# Altium project FYP_ECG_ACCEL_board.PrjPcb
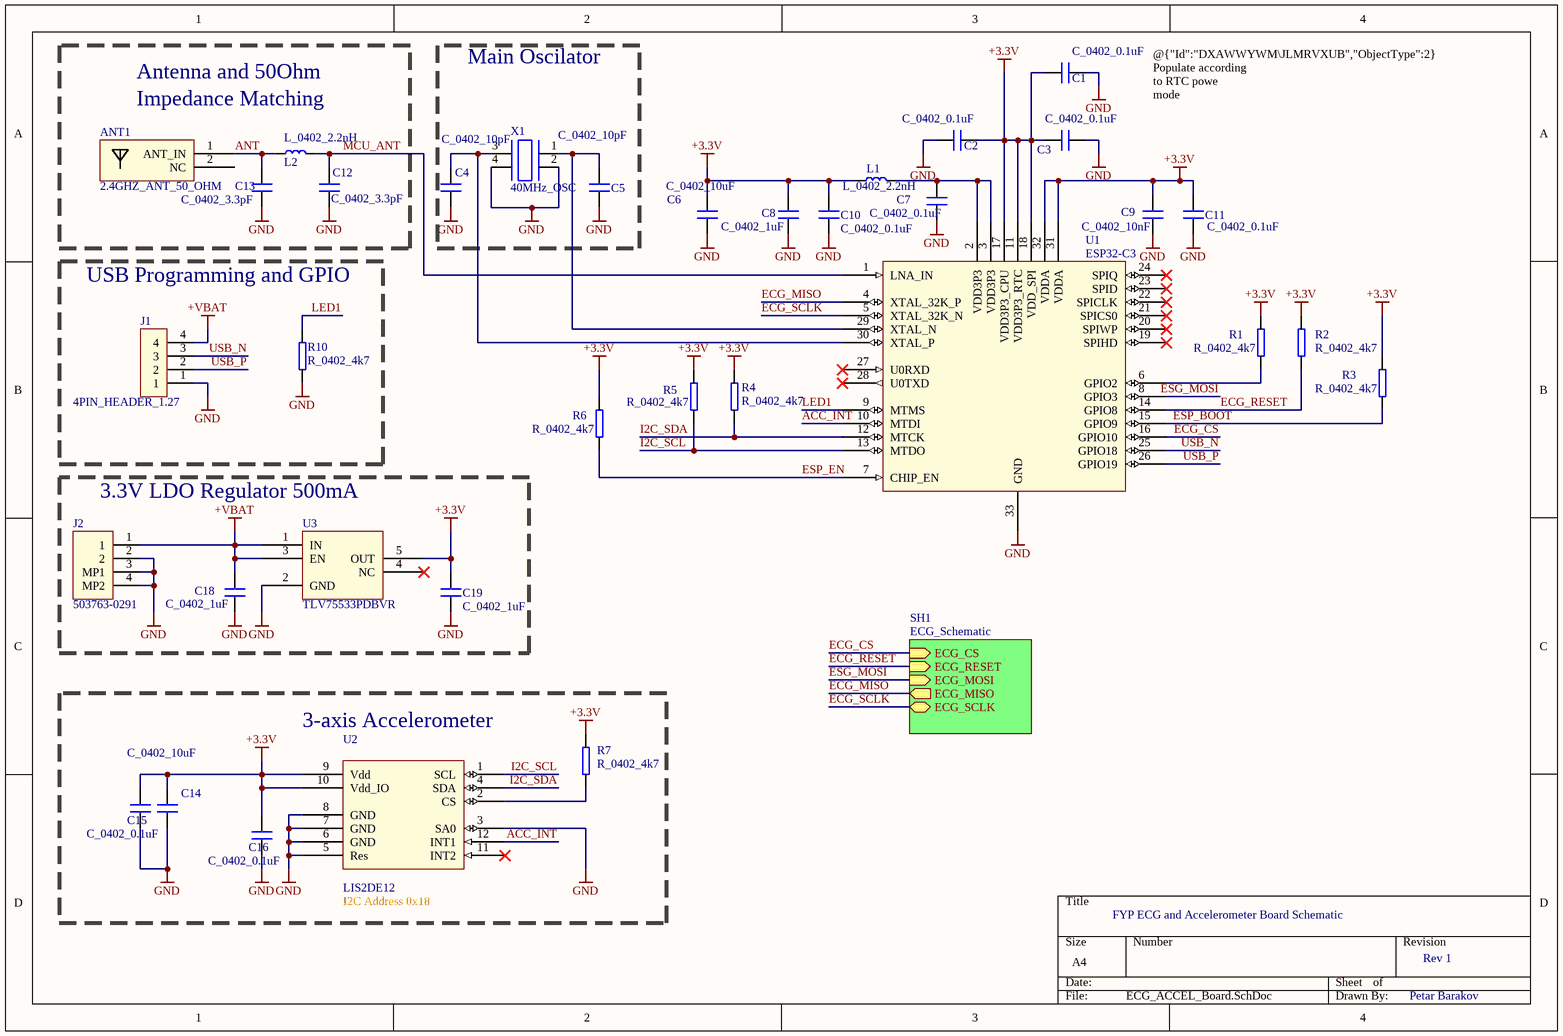
[diagram p0: ECG_ACCEL_Board.SchDoc]
Author: Petar Barakov; Revision: Rev 1
2 sheets, 55 parts. Net scope: hierarchical (ports join the sheet entries above them; power ports are global).
Board file: ECG_ACCEL_Board.PcbDoc
Sheets:
  ECG_ACCEL_Board.SchDoc
    SH1 = ECG_Schematic.SchDoc

## Sheet ECG_ACCEL_Board.SchDoc
size A4; SheetNumber: 1; SheetTotal: 2

### Parts
ANT1  2.4GHZ_ANT_50_OHM  [Chip2PinSM127P600-8N]
C1  C_0402_0.1uF  [C_0402]
C2  C_0402_0.1uF  [C_0402]
C3  C_0402_0.1uF  [C_0402]
C4  C_0402_10pF  [C_0402]
C5  C_0402_10pF  [C_0402]
C6  C_0402_10uF  [C_0402]
C7  C_0402_0.1uF  [C_0402]
C8  C_0402_1uF  [C_0402]
C9  C_0402_10nF  [C_0402]
C10  C_0402_0.1uF  [C_0402]
C11  C_0402_0.1uF  [C_0402]
C12  C_0402_3.3pF  [C_0402]
C13  C_0402_3.3pF  [C_0402]
C14  C_0402_10uF  [C_0402]
C15  C_0402_0.1uF  [C_0402]
C16  C_0402_0.1uF  [C_0402]
C18  C_0402_1uF  [C_0402]
C19  C_0402_1uF  [C_0402]
J1  4PIN_HEADER_1.27  [4PIN_HEADER_1.27-Footprint-1]
J2  503763-0291  [Molex 503763-0291]
L1  L_0402_2.2nH  [L_0402]
L2  L_0402_2.2nH  [L_0402]
R1  R_0402_4k7  [R_0402]
R2  R_0402_4k7  [R_0402]
R3  R_0402_4k7  [R_0402]
R4  R_0402_4k7  [R_0402]
R5  R_0402_4k7  [R_0402]
R6  R_0402_4k7  [R_0402]
R7  R_0402_4k7  [R_0402]
R10  R_0402_4k7  [R_0402]
U1  ESP32-C3  [QFN127P600-8N]
U2  LIS2DE12  [LIS2DE12-Footprint-1]
U3  TLV75533PDBVR  [SOT95P280X145-5N]
X1  40MHz_OSC  [40MHz_OSC-Footprint-1]

### Blocks framed on the sheet
Main Oscilator: C4 C5 X1
USB Programming and GPIO: J1 R10
3.3V LDO Regulator 500mA: C18 C19 J2 U3
3-axis Accelerometer: C14-C16 R7 U2

### Sub-sheets
SH1 = ECG_Schematic: ECG_CS (in), ECG_RESET (in), ECG_MOSI (in), ECG_MISO (out), ECG_SCLK (bidir)

### Nets
+3.3V: C1.1 C2.2 C3.1 C6.2 C8.2 C9.2 C10.1 C11.2 C14.2 C15.2 C16.2 C19.2 L1.1 R1.1 R2.1 R3.1 R4.1 R5.1 R6.1 R7.1 U1.11(VDD3P3_RTC) U1.17(VDD3P3_CPU) U1.18(VDD_SPI) U1.31(VDDA) U1.32(VDDA) U2.9(Vdd) U2.10(Vdd_IO) U3.5(OUT)
+VBAT: C18.2 J1.4 J2.1 U3.1(IN) U3.3(EN)
GND: C1.2 C2.1 C3.2 C4.1 C5.1 C6.1 C7.2 C8.1 C9.1 C10.2 C11.1 C12.1 C13.1 C14.1 C15.1 C16.1 C18.1 C19.1 J1.1 J2.2 J2.3(MP1) J2.4(MP2) R10.2 U1.33(GND) U2.3(SA0) U2.5(Res) U2.6(GND) U2.7(GND) U2.8(GND) U3.2(GND) X1.2 X1.4
ACC_INT: U1.10(MTDI) U2.12(INT1)
ANT: ANT1.1(ANT_IN) C13.2 L2.1
ECG_CS: U1.16(GPIO10) ; sheet SH1/ECG_CS
ECG_MISO: U1.4(XTAL_32K_P) ; sheet SH1/ECG_MISO  [project net ECG_DOUT]
ECG_RESET: R2.2 U1.14(GPIO8) ; sheet SH1/ECG_RESET
ECG_SCLK: U1.5(XTAL_32K_N) ; sheet SH1/ECG_SCLK
ESG_MOSI: U1.8(GPIO3) ; sheet SH1/ECG_MOSI  [project net ECG_DIN]
ESP_BOOT: R3.2 U1.15(GPIO9)
ESP_EN: R6.2 U1.7(CHIP_EN)
I2C_SCL: R5.2 U1.13(MTDO) U2.1(SCL)
I2C_SDA: R4.2 U1.12(MTCK) U2.4(SDA)
LED1: R10.1 U1.9(MTMS)
MCU_ANT: C12.2 L2.2 U1.1(LNA_IN)
USB_N: J1.3 U1.25(GPIO18)
USB_P: J1.2 U1.26(GPIO19)
NetC4_2: C4.2 U1.30(XTAL_P) X1.3
NetC5_2: C5.2 U1.29(XTAL_N) X1.1
NetC7_1: C7.1 L1.2 U1.2(VDD3P3) U1.3(VDD3P3)
NetR1_2: R1.2 U1.6(GPIO2)
NetR7_2: R7.2 U2.2(CS)

Not connected (* = marked no-connect by the designer): ANT1 2(NC); U1 19(SPIHD)* 20(SPIWP)* 21(SPICS0)* 22(SPICLK)* 23(SPID)* 24(SPIQ)* 27(U0RXD)* 28(U0TXD)*; U2 11(INT2)*; U3 4(NC)*

### Notes on the sheet
- Antenna and 50Ohm
- Impedance Matching
- @{"Id":"DXAWWYWM\JLMRVXUB","ObjectType":2}  Populate according to RTC powe mode configurations
- (near U2) I2C Address 0x18
- FYP ECG and Accelerometer Board Schematic

### Library data of the parts
ANT1 = CMP-00009-6: 2.4GHz Chip Antenna 50 Ohm Impedance ANT2012LL00R2400A; Order Code: 603-ANT2012LL00R2400; Distributor: Mouser
C1-C3 C7 C10 C11 C15 C16 = CMP-00055-1: JLC Part Number: C1525
C4 C5 = CMP-00051-1: JLC Part Number: C32949
C6 C14 = CMP-00052-1: JLC Part Number: C15525
C8 C18 C19 = CMP-00053-1: JLC Part Number: C52923
C9 = CMP-00054-1: JLC Part Number: C15195
C12 C13 = CMP-00056-1: JLC Part Number: C326841
J1 = CMP-00049-2: Order Code: 855-M50-3530442; Distributor: Mouser
J2 = CMP-007-000000-2: Molex 503763-0291; Order Code: 538-503763-0291; Design Item ID: 503763-0291; Distributor: Mouser
L1 L2 = CMP-00057-1: JLC Part Number: C92035
R1-R7 R10 = CMP-00050-1: JLC Part Number: C25900
U1 = CMP-00008-4: 33 pin ESP32_C3 Microcontroller; JLC Part Number: C2858491
U2 = CMP-00005-10: Accelerometers MEMS digital output motion sensor: ultra-low-power high-performance 3-axis "femt; Order Code: 511-LIS2DE12TR; JLC Part Number: C155639; Distributor: Mouser
U3 = CMP-00019-2: LDO Voltage Regulators 500-mA high-PSRR low-IQ low-dropout voltage regulator with enable 5-SOT-23 -40 to 125; JLC Part Number: C404027
X1 = CMP-00029-2: 40 MHZ Oscillator, 10pF load capacitance; JLC Part Number: C426988

## Sheet ECG_Schematic.SchDoc
size A4; SheetNumber: 2; SheetTotal: 2
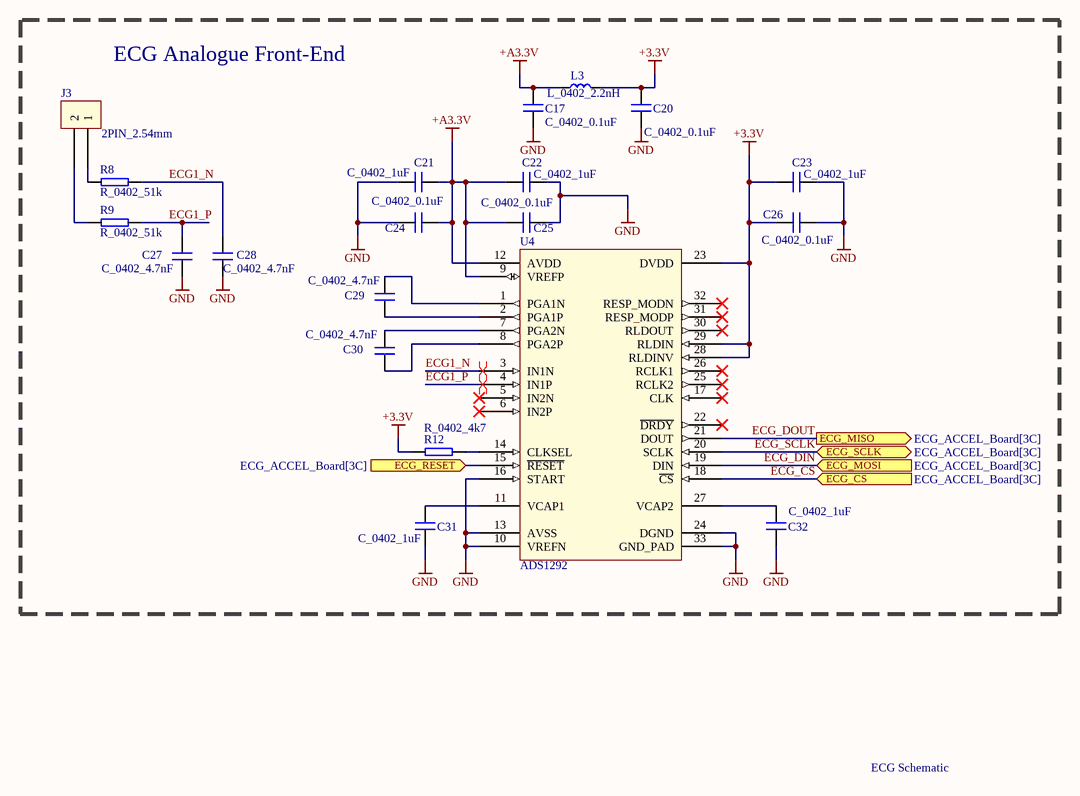
[diagram p1: ECG_Schematic.SchDoc]

### Parts
C17  C_0402_0.1uF  [C_0402]
C20  C_0402_0.1uF  [C_0402]
C21  C_0402_1uF  [C_0402]
C22  C_0402_1uF  [C_0402]
C23  C_0402_1uF  [C_0402]
C24  C_0402_0.1uF  [C_0402]
C25  C_0402_0.1uF  [C_0402]
C26  C_0402_0.1uF  [C_0402]
C27  C_0402_4.7nF  [C_0402]
C28  C_0402_4.7nF  [C_0402]
C29  C_0402_4.7nF  [C_0402]
C30  C_0402_4.7nF  [C_0402]
C31  C_0402_1uF  [C_0402]
C32  C_0402_1uF  [C_0402]
J3  2PIN_2.54mm  [2PIN_2.54mm-Footprint-1]
L3  L_0402_2.2nH  [L_0402]
R8  R_0402_51k  [R_0402]
R9  R_0402_51k  [R_0402]
R12  R_0402_4k7  [R_0402]
U4  ADS1292  [QFN127P600-8N]

### Blocks framed on the sheet
ECG Analogue Front-End: C17 C20-C32 J3 L3 R8 R9 R12 U4

### Ports
ECG_CS (in, see ECG_ACCEL_Board[3C]), ECG_MISO (out, see ECG_ACCEL_Board[3C]), ECG_MOSI (in, see ECG_ACCEL_Board[3C]), ECG_RESET (in, see ECG_ACCEL_Board[3C]), ECG_SCLK (bidir, see ECG_ACCEL_Board[3C])

### Nets
+3.3V: C20.2 C23.1 C26.1 L3.2 R12.2 U4.23(DVDD) U4.28(RLDINV) U4.29(RLDIN)
+A3.3V: C17.2 C21.2 C22.2 C24.2 C25.2 L3.1 U4.9(VREFP) U4.12(AVDD)
GND: C17.1 C20.1 C21.1 C22.1 C23.2 C24.1 C25.1 C26.2 C27.1 C28.1 C31.1 C32.1 U4.10(VREFN) U4.13(AVSS) U4.16(START) U4.24(DGND) U4.33(GND_PAD)
ECG1_N: C28.2 R8.1 U4.3(IN1N)
ECG1_P: C27.2 R9.1 U4.4(IN1P)
ECG_CS: U4.18(~{CS}) ; port ECG_CS
ECG_DIN: U4.19(DIN) ; port ECG_MOSI
ECG_DOUT: U4.21(DOUT) ; port ECG_MISO
ECG_RESET: U4.15(~{RESET}) ; port ECG_RESET
ECG_SCLK: U4.20(SCLK) ; port ECG_SCLK
NetC29_1: C29.1 U4.2(PGA1P)
NetC29_2: C29.2 U4.1(PGA1N)
NetC30_1: C30.1 U4.8(PGA2P)
NetC30_2: C30.2 U4.7(PGA2N)
NetC31_2: C31.2 U4.11(VCAP1)
NetC32_2: C32.2 U4.27(VCAP2)
NetJ3_1: J3.1 R8.2
NetJ3_2: J3.2 R9.2
NetR12_1: R12.1 U4.14(CLKSEL)

Not connected (* = marked no-connect by the designer): U4 5(IN2N)* 6(IN2P)* 17(CLK)* 22(~{DRDY})* 25(RCLK2)* 26(RCLK1)* 30(RLDOUT)* 31(RESP_MODP)* 32(RESP_MODN)*

### Layout directives
differential pair: ECG1_N, ECG1_P

### Notes on the sheet
- ECG Schematic

### Library data of the parts
C17 C20 C24-C26 = CMP-00055-1: JLC Part Number: C1525
C21-C23 C31 C32 = CMP-00053-1: JLC Part Number: C52923
C27-C30 = CMP-00064-1: JLC PArt Number: C1538
J3 = CMP-00018-3: 2 pin power input; JLC Part Number: C5360898
L3 = CMP-00057-1: JLC Part Number: C92035
R8 R9 = CMP-00063-1: JLC Part Number: C25794
R12 = CMP-00050-1: JLC Part Number: C25900
U4 = CMP-00026-5: ECG Analog Front End - AFE 2-Channel,24B ADC; Order Code: 595-ADS1292RIRSMT; Distributor: Mouser; JLC Part Number: C456281

## Nets that join several sheets
+3.3V: ECG_ACCEL_Board (28 pins), ECG_Schematic (8 pins)
GND: ECG_ACCEL_Board (32 pins), ECG_Schematic (17 pins)
ECG_CS: ECG_ACCEL_Board (U1.16), ECG_Schematic (U4.18)
ECG_DIN: ECG_ACCEL_Board (U1.8), ECG_Schematic (U4.19)
ECG_DOUT: ECG_ACCEL_Board (U1.4), ECG_Schematic (U4.21)
ECG_RESET: ECG_ACCEL_Board (R2.2 U1.14), ECG_Schematic (U4.15)
ECG_SCLK: ECG_ACCEL_Board (U1.5), ECG_Schematic (U4.20)

## Assembly variants
V1: not fitted ANT1 J1 J2 J3 R10 U2
V2_3d: not fitted J1 J3 R10